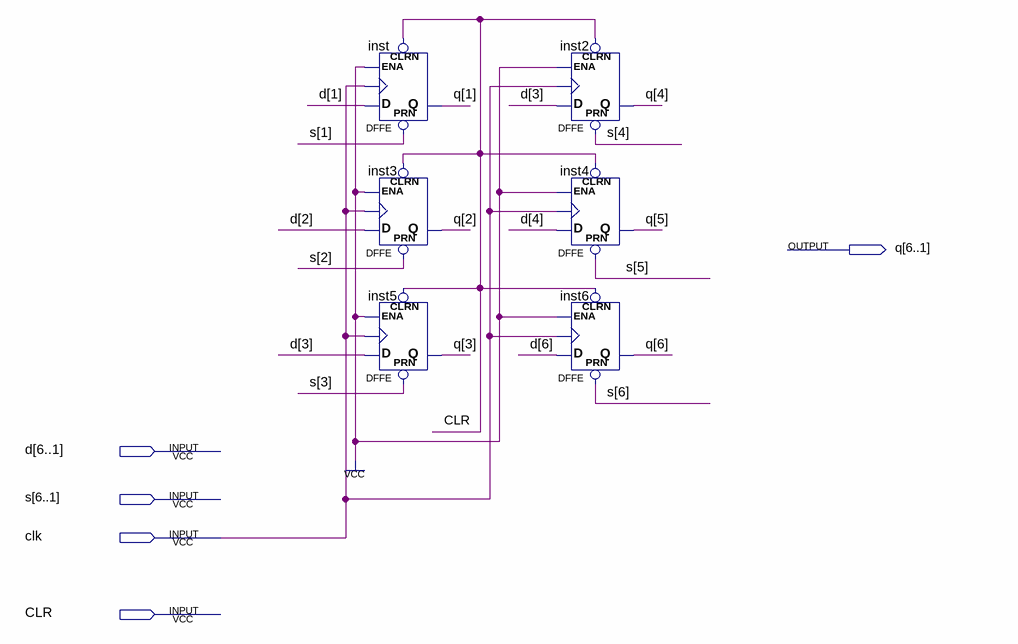
[diagram p0: schematic sheet]
// Quartus schematic uA_reg.bdf as structural Verilog: 6 symbols, 5 pins
module uA_reg (
  input  [6:1] d,
  input  [6:1] s,
  input  clk,
  input  CLR,
  output [6:1] q
);

  DFFE inst (.PRN(s[1]), .CLRN(CLR), .D(d[1]), .CLK(clk), .ENA(1'b1), .Q(q[1]));
  DFFE inst3 (.PRN(s[2]), .CLRN(CLR), .D(d[2]), .CLK(clk), .ENA(1'b1), .Q(q[2]));
  DFFE inst5 (.PRN(s[3]), .CLRN(CLR), .D(d[3]), .CLK(clk), .ENA(1'b1), .Q(q[3]));
  DFFE inst2 (.PRN(s[4]), .CLRN(CLR), .D(d[3]), .CLK(clk), .ENA(1'b1), .Q(q[4]));
  DFFE inst4 (.PRN(s[5]), .CLRN(CLR), .D(d[4]), .CLK(clk), .ENA(1'b1), .Q(q[5]));
  DFFE inst6 (.PRN(s[6]), .CLRN(CLR), .D(d[6]), .CLK(clk), .ENA(1'b1), .Q(q[6]));
endmodule
